# Altium project Main.PrjPCB (part 1 of 2)
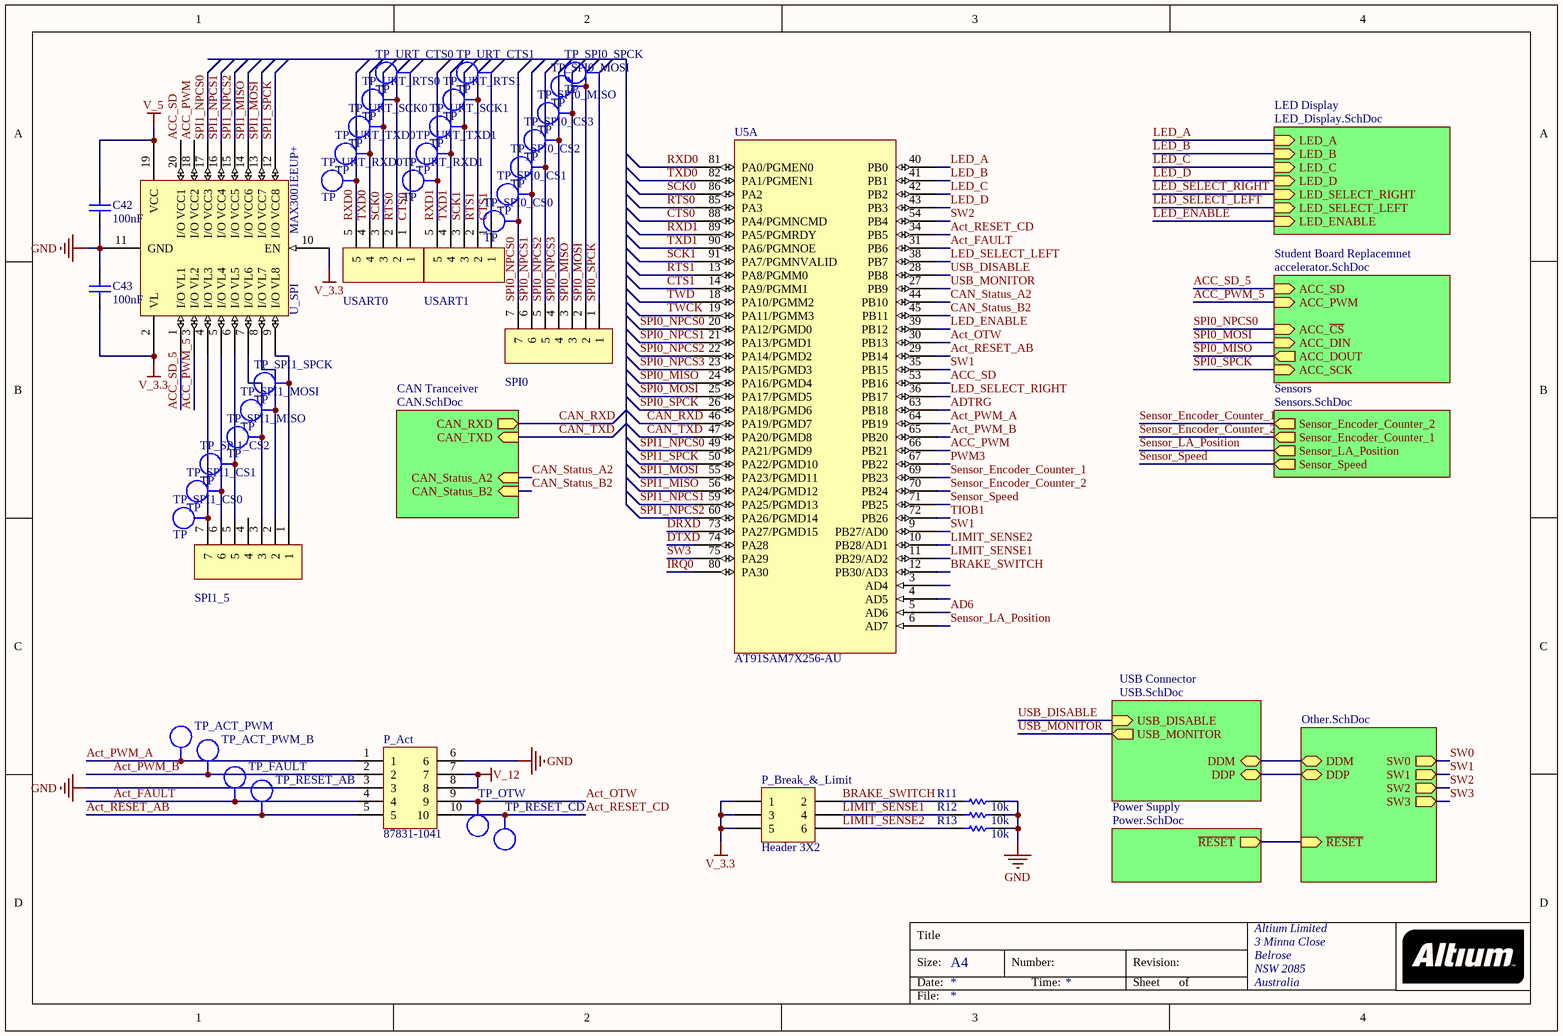
[diagram p0: Main.SchDoc]
8 sheets, 235 parts. Net scope: hierarchical (ports join the sheet entries above them; power ports are global).
Board file: Main.PcbDoc
Sheets:
  Main.SchDoc
     = Other.SchDoc
    CAN Tranceiver = CAN.SchDoc
    USB Connector = USB.SchDoc
    Power Supply = Power.SchDoc
    Sensors = Sensors.SchDoc
    Student Board Replacemnet = accelerator.SchDoc
    LED Display = LED_Display.SchDoc

## Sheet Main.SchDoc
size A4; Organization: Altium Limited; Address1: 3 Minna Close; Address2: Belrose; Address3: NSW 2085; Address4: Australia

### Parts
C42  100nF  [0603]
C43  100nF  [0603]
P_Act  87831-1041  [87831-1041]
P_Break_&_Limit  Header 3X2  [HDR2X3]
R11  10k  [0603]
R12  10k  [0603]
R13  10k  [0603]
SPI0  53261-0771  [53261-0771]  (value not drawn)
SPI1_5  53261-0771  [53261-0771]  (value not drawn)
TP_ACT_PWM  TP  [TEST_POINT_4X2MM]  (value not drawn)  (no BOM)
TP_ACT_PWM_B  TP  [TEST_POINT_4X2MM]  (value not drawn)  (no BOM)
TP_FAULT  TP  [TEST_POINT_4X2MM]  (value not drawn)  (no BOM)
TP_OTW  TP  [TEST_POINT_4X2MM]  (value not drawn)  (no BOM)
TP_RESET_AB  TP  [TEST_POINT_4X2MM]  (value not drawn)  (no BOM)
TP_RESET_CD  TP  [TEST_POINT_4X2MM]  (value not drawn)  (no BOM)
TP_SPI0_CS0  TP  [TEST_POINT_4X2MM]  (no BOM)
TP_SPI0_CS1  TP  [TEST_POINT_4X2MM]  (no BOM)
TP_SPI0_CS2  TP  [TEST_POINT_4X2MM]  (no BOM)
TP_SPI0_CS3  TP  [TEST_POINT_4X2MM]  (no BOM)
TP_SPI0_MISO  TP  [TEST_POINT_4X2MM]  (no BOM)
TP_SPI0_MOSI  TP  [TEST_POINT_4X2MM]  (no BOM)
TP_SPI0_SPCK  TP  [TEST_POINT_4X2MM]  (no BOM)
TP_SPI1_CS0  TP  [TEST_POINT_4X2MM]  (no BOM)
TP_SPI1_CS1  TP  [TEST_POINT_4X2MM]  (no BOM)
TP_SPI1_CS2  TP  [TEST_POINT_4X2MM]  (no BOM)
TP_SPI1_MISO  TP  [TEST_POINT_4X2MM]  (no BOM)
TP_SPI1_MOSI  TP  [TEST_POINT_4X2MM]  (no BOM)
TP_SPI1_SPCK  TP  [TEST_POINT_4X2MM]  (no BOM)
TP_URT_CTS0  TP  [TEST_POINT_4X2MM]  (no BOM)
TP_URT_CTS1  TP  [TEST_POINT_4X2MM]  (no BOM)
TP_URT_RTS0  TP  [TEST_POINT_4X2MM]  (no BOM)
TP_URT_RTS1  TP  [TEST_POINT_4X2MM]  (no BOM)
TP_URT_RXD0  TP  [TEST_POINT_4X2MM]  (no BOM)
TP_URT_RXD1  TP  [TEST_POINT_4X2MM]  (no BOM)
TP_URT_SCK0  TP  [TEST_POINT_4X2MM]  (no BOM)
TP_URT_SCK1  TP  [TEST_POINT_4X2MM]  (no BOM)
TP_URT_TXD0  TP  [TEST_POINT_4X2MM]  (no BOM)
TP_URT_TXD1  TP  [TEST_POINT_4X2MM]  (no BOM)
U5  AT91SAM7X256-AU  [LQFP100_N]  (part A of 4)
U_SPI  MAX3001EEUP+  [TSOP65P640X110-20N]
USART0  53261-0571  [53261-0571]  (value not drawn)
USART1  53261-0571  [53261-0571]  (value not drawn)

### Sub-sheets
CAN Tranceiver = CAN.SchDoc: CAN_TXD (in), CAN_RXD (out), CAN_Status_A2 (in), CAN_Status_B2 (in)
LED Display = LED_Display.SchDoc: LED_ENABLE (in), LED_A (in), LED_B (in), LED_C (in), LED_D (in), LED_SELECT_LEFT (in), LED_SELECT_RIGHT (in)
Power Supply = Power.SchDoc: ~{RESET} (out)
Sensors = Sensors.SchDoc: Sensor_Speed (out), Sensor_LA_Position (out), Sensor_Encoder_Counter_2 (out), Sensor_Encoder_Counter_1 (out)
Student Board Replacemnet = accelerator.SchDoc: ACC_PWM (in), ACC_SD (in), ACC_~{CS} (in), ACC_DIN (in), ACC_DOUT (out), ACC_SCK (in)
USB Connector = USB.SchDoc: USB_DISABLE (in), USB_MONITOR (out), DDM (bidir), DDP (bidir)
? = Other.SchDoc: DDM (bidir), DDP (bidir), ~{RESET} (in), SW2 (out), SW3 (out), SW0 (out), SW1 (out)

### Nets
GND: C42.1 C43.2 P_Act.3 P_Act.6 R11.2 R12.2 R13.2 U_SPI.11(GND)
V_3.3: C43.1 P_Break_&_Limit.1 P_Break_&_Limit.3 P_Break_&_Limit.5 U_SPI.2(VL) U_SPI.10(EN)
V_5: C42.2 U_SPI.19(VCC)
V_12: P_Act.7 P_Act.8
ACC_PWM: U5.66(PB21) U_SPI.18(I/O_VCC2)
ACC_PWM_5: U_SPI.3(I/O_VL2) ; sheet Student Board Replacemnet/ACC_PWM
ACC_SD: U5.53(PB16) U_SPI.20(I/O_VCC1)
ACC_SD_5: U_SPI.1(I/O_VL1) ; sheet Student Board Replacemnet/ACC_SD
Act_FAULT: P_Act.4 TP_FAULT.1 U5.31(PB6)
Act_OTW: P_Act.9 TP_OTW.1 U5.30(PB13)
Act_PWM_A: P_Act.1 TP_ACT_PWM.1 U5.64(PB19)
Act_PWM_B: P_Act.2 TP_ACT_PWM_B.1 U5.65(PB20)
Act_RESET_AB: P_Act.5 TP_RESET_AB.1 U5.29(PB14)
Act_RESET_CD: P_Act.10 TP_RESET_CD.1 U5.34(PB5)
AD6: U5.5(AD6)
ADTRG: U5.63(PB18)
BRAKE_SWITCH: P_Break_&_Limit.2 R11.1 U5.12(PB30/AD3)
CAN_RXD: U5.46(PA19/PGMD7) ; sheet CAN Tranceiver/CAN_RXD
CAN_Status_A2: U5.44(PB10) ; sheet CAN Tranceiver/CAN_Status_A2
CAN_Status_B2: U5.45(PB11) ; sheet CAN Tranceiver/CAN_Status_B2
CAN_TXD: U5.47(PA20/PGMD8) ; sheet CAN Tranceiver/CAN_TXD
CTS0: TP_URT_CTS0.1 U5.88(PA4/PGMNCMD) USART0.1
CTS1: TP_URT_CTS1.1 U5.14(PA9/PGMM1) USART1.1
DRXD: U5.73(PA27/PGMD15)
DTXD: U5.74(PA28)
IRQ0: U5.80(PA30)
LED_A: U5.40(PB0) ; sheet LED Display/LED_A
LED_B: U5.41(PB1) ; sheet LED Display/LED_B
LED_C: U5.42(PB2) ; sheet LED Display/LED_C
LED_D: U5.43(PB3) ; sheet LED Display/LED_D
LED_ENABLE: U5.39(PB12) ; sheet LED Display/LED_ENABLE
LED_SELECT_LEFT: U5.38(PB7) ; sheet LED Display/LED_SELECT_LEFT
LED_SELECT_RIGHT: U5.36(PB17) ; sheet LED Display/LED_SELECT_RIGHT
LIMIT_SENSE1: P_Break_&_Limit.4 R12.1 U5.11(PB29/AD2)
LIMIT_SENSE2: P_Break_&_Limit.6 R13.1 U5.10(PB28/AD1)
PWM3: U5.67(PB22)
RST: sheet /~{RESET}, sheet Power Supply/~{RESET}
RTS0: TP_URT_RTS0.1 U5.85(PA3) USART0.2
RTS1: TP_URT_RTS1.1 U5.13(PA8/PGMM0) USART1.2
RXD0: TP_URT_RXD0.1 U5.81(PA0/PGMEN0) USART0.5
RXD1: TP_URT_RXD1.1 U5.89(PA5/PGMRDY) USART1.5
SCK0: TP_URT_SCK0.1 U5.86(PA2) USART0.3
SCK1: TP_URT_SCK1.1 U5.91(PA7/PGMNVALID) USART1.3
Sensor_Encoder_Counter_1: U5.69(PB23) ; sheet Sensors/Sensor_Encoder_Counter_2
Sensor_Encoder_Counter_2: U5.70(PB24) ; sheet Sensors/Sensor_Encoder_Counter_1
Sensor_LA_Position: U5.6(AD7) ; sheet Sensors/Sensor_LA_Position
Sensor_Speed: U5.71(PB25) ; sheet Sensors/Sensor_Speed
SPI0_MISO: SPI0.3 TP_SPI0_MISO.1 U5.24(PA16/PGMD4) ; sheet Student Board Replacemnet/ACC_DOUT
SPI0_MOSI: SPI0.2 TP_SPI0_MOSI.1 U5.25(PA17/PGMD5) ; sheet Student Board Replacemnet/ACC_DIN
SPI0_NPCS0: SPI0.7 TP_SPI0_CS0.1 U5.20(PA12/PGMD0) ; sheet Student Board Replacemnet/ACC_~{CS}
SPI0_NPCS1: SPI0.6 TP_SPI0_CS1.1 U5.21(PA13/PGMD1)
SPI0_NPCS2: SPI0.5 TP_SPI0_CS2.1 U5.22(PA14/PGMD2)
SPI0_NPCS3: SPI0.4 TP_SPI0_CS3.1 U5.23(PA15/PGMD3)
SPI0_SPCK: SPI0.1 TP_SPI0_SPCK.1 U5.26(PA18/PGMD6) ; sheet Student Board Replacemnet/ACC_SCK
SPI1_MISO: U5.56(PA24/PGMD12) U_SPI.14(I/O_VCC6)
SPI1_MOSI: U5.55(PA23/PGMD11) U_SPI.13(I/O_VCC7)
SPI1_NPCS0: U5.49(PA21/PGMD9) U_SPI.17(I/O_VCC3)
SPI1_NPCS1: U5.59(PA25/PGMD13) U_SPI.16(I/O_VCC4)
SPI1_NPCS2: U5.60(PA26/PGMD14) U_SPI.15(I/O_VCC5)
SPI1_SPCK: U5.50(PA22/PGMD10) U_SPI.12(I/O_VCC8)
SW1: U5.9(PB27/AD0) U5.35(PB15) ; sheet /SW1
SW2: U5.54(PB4) ; sheet /SW2
SW3: U5.75(PA29) ; sheet /SW3
TIOB1: U5.72(PB26)
TWCK: U5.19(PA11/PGMM3)
TWD: U5.18(PA10/PGMM2)
TXD0: TP_URT_TXD0.1 U5.82(PA1/PGMEN1) USART0.4
TXD1: TP_URT_TXD1.1 U5.90(PA6/PGMNOE) USART1.4
USB_DISABLE: U5.28(PB8) ; sheet USB Connector/USB_DISABLE
USB_MONITOR: U5.27(PB9) ; sheet USB Connector/USB_MONITOR
NetR71_1: sheet /DDM, sheet USB Connector/DDM
NetR72_1: sheet /DDP, sheet USB Connector/DDP
NetSPI1_5_1: SPI1_5.1 TP_SPI1_SPCK.1 U_SPI.9(I/O_VL8)
NetSPI1_5_2: SPI1_5.2 TP_SPI1_MOSI.1 U_SPI.8(I/O_VL7)
NetSPI1_5_3: SPI1_5.3 TP_SPI1_MISO.1 U_SPI.7(I/O_VL6)
NetSPI1_5_5: SPI1_5.5 TP_SPI1_CS2.1 U_SPI.6(I/O_VL5)
NetSPI1_5_6: SPI1_5.6 TP_SPI1_CS1.1 U_SPI.5(I/O_VL4)
NetSPI1_5_7: SPI1_5.7 TP_SPI1_CS0.1 U_SPI.4(I/O_VL3)

Not connected (* = marked no-connect by the designer): SPI1_5 4; U5 3(AD4) 4(AD5)

### Notes on the sheet
- Title
- Size:
- Date:
- A4
- Number:
- Time:
- Revision:
- Sheet
- of
- File:

### Library data of the parts
C42 C43 = CP_100nF 0603: CAP CER .10UF 50V X5R 0603; Manufacturer: Taiyo Yuden; Manufacturer PN: UMK107B7104KA-T; LatestRevisionDate: 29 May 08; Supplier 1: Digi-Key; Supplier Part Number 1: 478-6206-1-ND; Value: 100nF; Part Number: CP_100nF 0603; Component Kind: Standard; Component Type: Standard; Designator: CP_100nF 0603; Pin Count: 2; Signal Integrity: Cap; Simulation: CAP
P_Act = 87831-1041: HEADER MALE 10POS VERT W/LOCK; Manufacturer: Molex; Manufacturer PN: 87831-1041; Supplier 1: Digi-Key; Supplier Part Number 1: WM3591-ND
P_Break_&_Limit = Header 3X2: Header, 3-Pin, Dual row; LatestRevisionDate: 17-Jul-2002; LatestRevisionNote: Re-released for DXP Platform.; Publisher: Altium Limited
R11-R13 = RS_10k 0603: RES 10.0K OHM 1/10W 1% 0603 SMD; Manufacturer: Yageo; Manufacturer PN: RC0603FR-0710KL; LatestRevisionDate: 29 May 08; Supplier 1: Digi-Key; Supplier Part Number 1: 311-10.0KHRTR-ND; Value: 10k; Part Number: RS_10k 0603; Component Kind: Standard; Component Type: Standard; Designator: RS_10k 0603; Pin Count: 2; Signal Integrity: Res; Simulation: RESISTOR
SPI0 SPI1_5 = 53261-0771: 7-pin PicoBlade Right-angle Header; Manufacturer: Molex; Manufacturer Part Number: 53261-0771
  SPI0: Supplier: Digikey; Supplier Part Number: WM7625CT-ND
  SPI1_5: Supplier 1: Digikey; Supplier Part Number 1: WM7625CT-ND
TP_ACT_PWM TP_ACT_PWM_B TP_FAULT TP_OTW TP_RESET_AB TP_RESET_CD TP_SPI0_CS0-TP_SPI0_CS3 TP_SPI0_MISO TP_SPI0_MOSI TP_SPI0_SPCK TP_SPI1_CS0-TP_SPI1_CS2 TP_SPI1_MISO TP_SPI1_MOSI TP_SPI1_SPCK TP_URT_CTS0 TP_URT_CTS1 TP_URT_RTS0 TP_URT_RTS1 TP_URT_RXD0 TP_URT_RXD1 TP_URT_SCK0 TP_URT_SCK1 TP_URT_TXD0 TP_URT_TXD1 = TP_TESTPOINT: Test-Point; LatestRevisionDate: 29 May 08; Manufacturer PN: *; Manufacturer: *; Supplier 1: Digi-Key; Supplier Part Number 1: 5016KTR-ND; Value: TP; Part Number: TP_TESTPOINT; Component Type: Standard (No BOM); Designator: TP_TESTPOINT; Pin Count: 1
U5 = AT91SAM7X256-AU: ARM7TDMI 32-Bit RISC CPU 256KB Flash and 64KB SRAM; Manafacture Part Number: AT91SAM7XC256B-AU; Manafacture: Atmel; Published: 16-Oct-2006; DatasheetVersion: 17-Oct-2005; PackageVersion: Apr-2006; PackageReference: LQFP100; Publisher: Altium Limited; PackageDescription: 100-Pin Thin Quad Flat Pack 0.5 mm Pitch; Code_JEDEC: MS-026-BED; ComponentLink1Description: Manufacturer Link; ComponentLink1URL: http://www.atmel.com; ComponentLink2Description: Datasheet; ComponentLink2URL: http://www.atmel.com/dyn/resources/prod_documents/6120s.pdf; Supplier 1: Digi-Key; Supplier Part Number 1: AT91SAM7XC256B-AU-ND
U_SPI = MAX3001EEUP+: Manufacture: MAXIM INTEGRATED PRODUCTS; Supplier Part Number 1: 1379763; Supplier 1: Element 14; Manufacture PN: MAX3001EEUP+
USART0 USART1 = 53261-0571: 5-pin PicoBlade Right-angle Header; Manufacturer: Molex; Manufacturer Part Number: 53261-0571
  USART0: Supplier: Digikey; Supplier Part Number: WM7623CT-ND
  USART1: Supplier 1: Digikey; Supplier Part Number 1: WM7623CT-ND

## Sheet Other.SchDoc
size A4; Organization: Altium Limited; Address1: 3 Minna Close; Address2: Belrose; Address3: NSW 2085; Address4: Australia
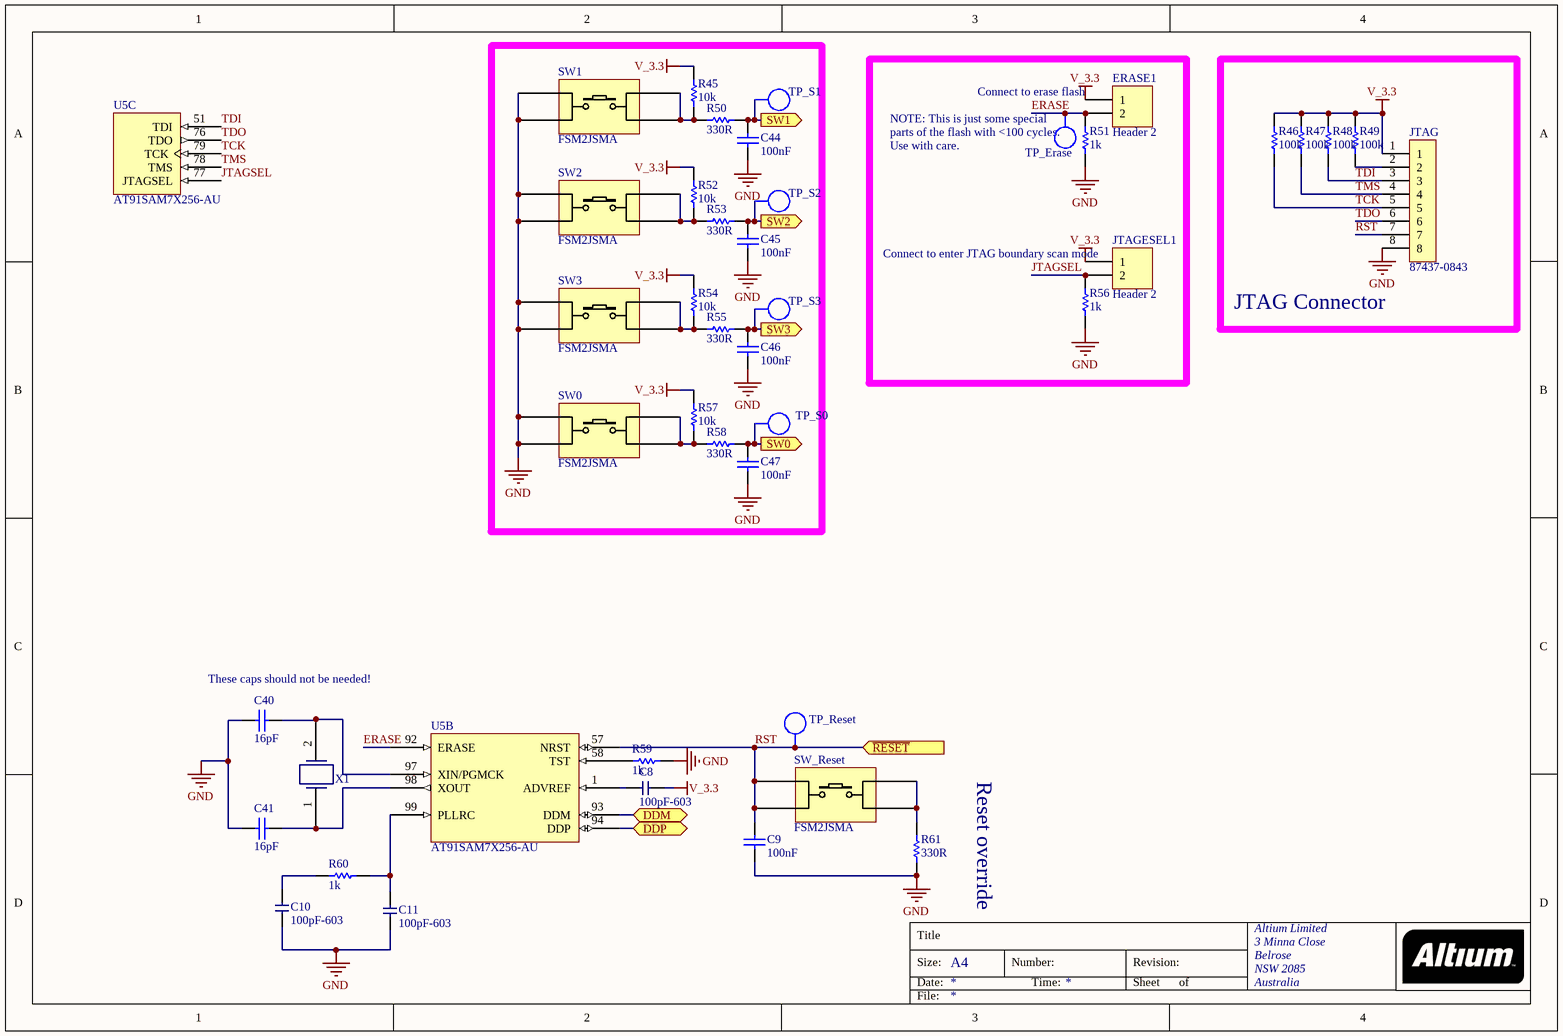
[diagram p1: Other.SchDoc]

### Parts
C8  100pF-603  [0603 Resistor]
C9  100nF  [0603]
C10  100pF-603  [0603 Resistor]
C11  100pF-603  [0603 Resistor]
C40  16pF  [0603]
C41  16pF  [0603]
C44  100nF  [0603]
C45  100nF  [0603]
C46  100nF  [0603]
C47  100nF  [0603]
ERASE1  Header 2  [HDR1X2]
JTAG  87437-0843  [87437-0843]
JTAGESEL1  Header 2  [HDR1X2]
R45  10k  [0603]
R46  100k  [0603]
R47  100k  [0603]
R48  100k  [0603]
R49  100k  [0603]
R50  330R  [0603]
R51  1k  [0603]
R52  10k  [0603]
R53  330R  [0603]
R54  10k  [0603]
R55  330R  [0603]
R56  1k  [0603]
R57  10k  [0603]
R58  330R  [0603]
R59  1k  [0603]
R60  1k  [0603]
R61  330R  [0603]
SW0  FSM2JSMA  [FSM2JSMA]
SW1  FSM2JSMA  [FSM2JSMA]
SW2  FSM2JSMA  [FSM2JSMA]
SW3  FSM2JSMA  [FSM2JSMA]
SW_Reset  FSM2JSMA  [FSM2JSMA]
TP_Erase  TP  [TEST_POINT_4X2MM]  (value not drawn)  (no BOM)
TP_Reset  TP  [TEST_POINT_4X2MM]  (value not drawn)  (no BOM)
TP_S0  TP  [TEST_POINT_4X2MM]  (value not drawn)  (no BOM)
TP_S1  TP  [TEST_POINT_4X2MM]  (value not drawn)  (no BOM)
TP_S2  TP  [TEST_POINT_4X2MM]  (value not drawn)  (no BOM)
TP_S3  TP  [TEST_POINT_4X2MM]  (value not drawn)  (no BOM)
U5  AT91SAM7X256-AU  [LQFP100_N]  (parts B,C of 4)
X1  ECS-184-20-5PXDU-TR  [HC49/US]  (value not drawn)

### Blocks framed on the sheet
JTAG Connector: JTAG R46-R49

### Ports
DDM (bidir), DDP (bidir), SW0 (out), SW1 (out), SW2 (out), SW3 (out), ~{RESET} (in)

### Nets
GND: C9.2 C10.1 C11.1 C40.1 C41.2 C44.1 C45.1 C46.1 C47.1 JTAG.8 R51.1 R56.1 R59.1 R61.1 SW0.1 SW0.2 SW1.1 SW1.2 SW2.1 SW2.2 SW3.1 SW3.2
V_3.3: C8.2 ERASE1.1 JTAG.1 JTAGESEL1.1 R45.2 R46.1 R47.1 R48.1 R49.1 R52.2 R54.2 R57.2
ERASE: ERASE1.2 R51.2 TP_Erase.1 U5.92(ERASE)
JTAGSEL: JTAGESEL1.2 R56.2 U5.77(JTAGSEL)
RST: C9.1 JTAG.7 SW_Reset.1 SW_Reset.2 TP_Reset.1 U5.57(NRST) ; port ~{RESET}
SW0: C47.2 R58.2 TP_S0.1 ; port SW0
SW1: C44.2 R50.2 TP_S1.1 ; port SW1
SW2: C45.2 R53.2 TP_S2.1 ; port SW2
SW3: C46.2 R55.2 TP_S3.1 ; port SW3
TCK: JTAG.5 R46.2 U5.79(TCK)
TDI: JTAG.3 R48.2 U5.51(TDI)
TDO: JTAG.6 U5.76(TDO)
TMS: JTAG.4 R47.2 U5.78(TMS)
NetC8_1: C8.1 U5.1(ADVREF)
NetC10_2: C10.2 R60.1
NetC11_2: C11.2 R60.2 U5.99(PLLRC)
NetC40_2: C40.2 U5.97(XIN/PGMCK) X1.2
NetC41_1: C41.1 U5.98(XOUT) X1.1
NetJTAG_2: JTAG.2 R49.2
NetR45_1: R45.1 R50.1 SW1.3 SW1.4
NetR52_1: R52.1 R53.1 SW2.3 SW2.4
NetR54_1: R54.1 R55.1 SW3.3 SW3.4
NetR57_1: R57.1 R58.1 SW0.3 SW0.4
NetR59_2: R59.2 U5.58(TST)
NetR61_2: R61.2 SW_Reset.3 SW_Reset.4
NetR71_1: U5.93(DDM) ; port DDM
NetR72_1: U5.94(DDP) ; port DDP

### Notes on the sheet
- (near ERASE1) Connect to erase flash
- (near TP_Erase) NOTE: This is just some special
- parts of the flash with <100 cycles.
- Use with care.
- (near JTAGESEL1) Connect to enter JTAG boundary scan mode
- (near C40) These caps should not be needed!
- Reset override
- Title
- Size:
- Date:
- A4
- Number:
- Time:
- Revision:
- Sheet
- of
- File:

### Library data of the parts
C8 C10 C11 = 100pF-603: Manufacturer Part Number: 06035A101JAT2A; Manufacturer: AVX Corporation; Supplier 1: Digi-Key; Supplier Part Number 1: 478-1175-1-ND
C9 C44-C47 = CP_100nF 0603: as C42 on sheet Main; Value: 100nF; Part Number: CP_100nF 0603; Component Kind: Standard; Component Type: Standard; Designator: CP_100nF 0603; Pin Count: 2; LatestRevisionDate: 29 May 08; Supplier 1: Digi-Key; Supplier Part Number 1: 478-6206-1-ND; Signal Integrity: Cap; Simulation: CAP
C40 C41 = CP_16pF_100V_0603: CAP CER 16PF 100V 5% C0G 0603; Manufacturer: Murata; Manufacturer PN: GRM1885C2A160JA01D; Supplier 1: Digi-Key; Supplier Part Number 1: 490-1332-1-ND; Value: 16pF; Part Number: CP_16pF_100V_0603; Component Kind: Standard; Component Type: Standard; Designator: CP_16pF_100V_0603; Pin Count: 2; Signal Integrity: Cap; Simulation: CAP
ERASE1 JTAGESEL1 = Header 2: Header, 2-Pin; LatestRevisionDate: 17-Jul-2002; LatestRevisionNote: Re-released for DXP Platform.; Publisher: Altium Limited
JTAG = 87437-0843: Manufacturer: Molex; Manufacturer Part Number: 87437-0843; Supplier 1: Digikey; Supplier Part Number 1: WM7667CT-ND
R45 R52 R54 R57 = RS_10k 0603: as R11 on sheet Main; LatestRevisionDate: 29 May 08; Supplier 1: Digi-Key; Supplier Part Number 1: 311-10.0KHRTR-ND; Value: 10k; Part Number: RS_10k 0603; Component Kind: Standard; Component Type: Standard; Designator: RS_10k 0603; Pin Count: 2; Signal Integrity: Res; Simulation: RESISTOR
R46-R49 = RS_100k 0603: RES 100K OHM 1/10W 1% 0603 SMD; Manufacturer: Yageo; Manufacturer PN: RC0603FR-07100KL; Value: 100k; Part Number: RS_100k 0603; Component Kind: Standard; Component Type: Standard; Designator: RS_100k 0603; Pin Count: 2; LatestRevisionDate: 1 Jun 08; Supplier 1: Digi-Key; Supplier Part Number 1: 311-100KHRTR-ND; Signal Integrity: Res; Simulation: RESISTOR
R50 R53 R55 R58 R61 = RS_330R 0603: RES 330 OHM 1/10W 1% 0603 SMD; Manufacturer: Yageo; Manufacturer PN: RC0603FR-07330RL; LatestRevisionDate: 25 June 2009; Supplier 1: Digi-Key; Supplier Part Number 1: 311-330HRTR-ND; Value: 330R; Part Number: RS_330R 0603; Component Kind: Standard; Component Type: Standard; Designator: RS_330R 0603; Pin Count: 2; Signal Integrity: Res; Simulation: RESISTOR
R51 R56 R59 R60 = RS_1k 0603: RES 1.00K OHM 1/10W 1% 0603 SMD; Manufacturer: ROHM; Manufacturer PN: MCR03EZPFX1001; Value: 1k; Part Number: RS_1k 0603; Component Kind: Standard; Component Type: Standard; Designator: RS_1k 0603; Pin Count: 2; LatestRevisionDate: 17-Jul-2002; Supplier 1: Digi-Key; Supplier Part Number 1: RHM1.00KHTR-ND; Signal Integrity: Res; Simulation: RESISTOR
SW0-SW3 SW_Reset = SW_FSM2JSMA: DPST SMD Switch; Manufacturer: Tyco Electronics; Supplier 1: Element 14; Supplier Part Number 1: 3801287; price: 0.516; Supplier 2: Digi-Key; Supplier Part Number 2: 450-1130-ND; value: FSM2JSMA; Part Number: SW_FSM2JSMA; Component Kind: Standard; Component Type: Standard; Designator: SW_FSM2JSMA; Pin Count: 4
TP_Erase TP_Reset TP_S0-TP_S3 = TP_TESTPOINT: Test-Point; LatestRevisionDate: 29 May 08; Manufacturer PN: *; Manufacturer: *; Supplier 1: Digi-Key; Supplier Part Number 1: 5016KTR-ND; Value: TP; Part Number: TP_TESTPOINT; Component Type: Standard (No BOM); Designator: TP_TESTPOINT; Pin Count: 1
U5 = AT91SAM7X256-AU: Smart ARM Microcontroller, ARM7TDMI 32-Bit RISC CPU, 256KB Flash and 64KB SRAM, 100-Pin LQFP, Industrial, Pb-Free; Published: 16-Oct-2006; DatasheetVersion: 17-Oct-2005; PackageVersion: Apr-2006; PackageReference: LQFP100; Publisher: Altium Limited; PackageDescription: 100-Pin Thin Quad Flat Pack 0.5 mm Pitch; Code_JEDEC: MS-026-BED; ComponentLink1Description: Manufacturer Link; ComponentLink1URL: http://www.atmel.com; ComponentLink2Description: Datasheet; ComponentLink2URL: http://www.atmel.com/dyn/resources/prod_documents/6120s.pdf
X1 = ECS-184-20-5PXDU-TR: Manufacturer: ECS Inc; Supplier 1: Digikey; Manufacturer Part Number: ECS-184-20-5PXDU-TR; Supplier Part Number 1: XC1536CT-ND

## Sheet CAN.SchDoc: CAN Bus
size A4; Organization: ENEL429 Group N; Address1: ECE Department; Address2: University of Canterbury; Address3: Christchurch 8041; Address4: New Zealand; Revision: 1
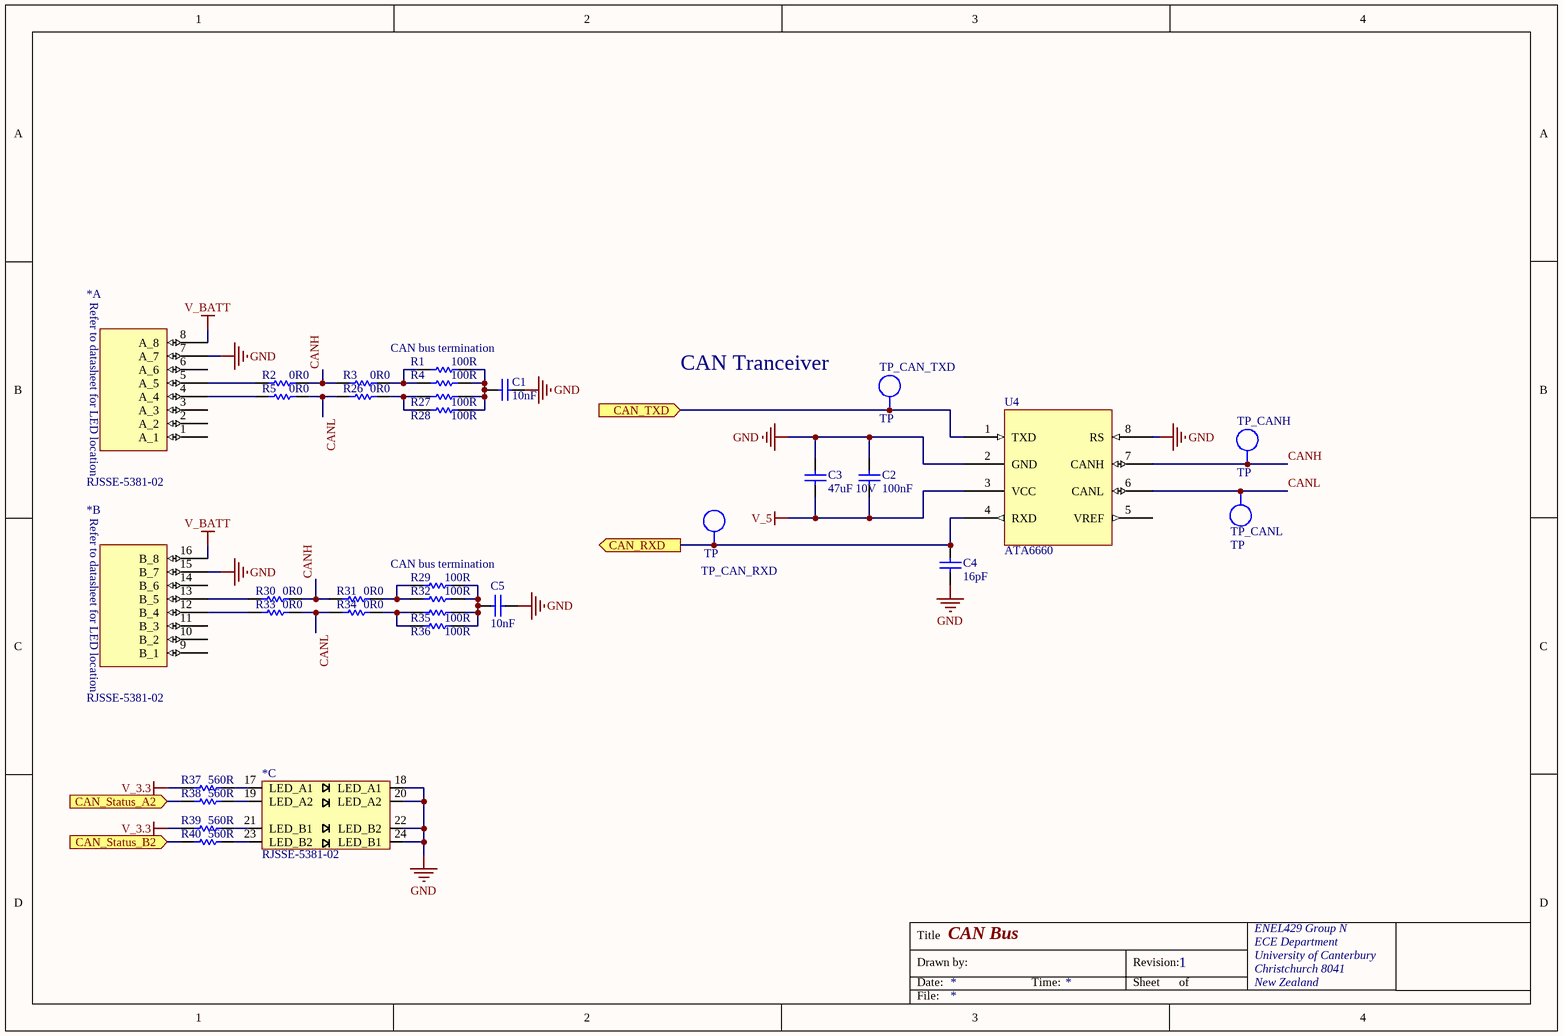
[diagram p2: CAN.SchDoc]

### Parts
(Parts that share a designator on the sheet are numbered #1, #2 ... from top to bottom, then left to right.)
*#1  RJSSE-5381-02  [RJSSE-5381-02]  (part A of 3)
*#2  RJSSE-5381-02  [RJSSE-5381-02]  (part B of 3)
*#3  RJSSE-5381-02  [RJSSE-5381-02]  (part C of 3)
C1  10nF  [0603]
C2  100nF  [0603]
C3  47uF 10V  [1210]
C4  16pF  [0603]
C5  10nF  [0603]
R1  100R  [0603]
R2  0R0  [0603]  (no BOM)
R3  0R0  [0603]  (no BOM)
R4  100R  [0603]
R5  0R0  [0603]  (no BOM)
R26  0R0  [0603]  (no BOM)
R27  100R  [0603]
R28  100R  [0603]
R29  100R  [0603]
R30  0R0  [0603]  (no BOM)
R31  0R0  [0603]  (no BOM)
R32  100R  [0603]
R33  0R0  [0603]  (no BOM)
R34  0R0  [0603]  (no BOM)
R35  100R  [0603]
R36  100R  [0603]
R37  560R  [0603]
R38  560R  [0603]
R39  560R  [0603]
R40  560R  [0603]
TP_CAN_RXD  TP  [TEST_POINT_4X2MM]  (no BOM)
TP_CAN_TXD  TP  [TEST_POINT_4X2MM]  (no BOM)
TP_CANH  TP  [TEST_POINT_4X2MM]  (no BOM)
TP_CANL  TP  [TEST_POINT_4X2MM]  (no BOM)
U4  ATA6660  [SOIC127P600X150-8N]

### Ports
CAN_RXD (out), CAN_Status_A2 (in), CAN_Status_B2 (in), CAN_TXD (in)

### Nets
GND: *#1.7(A_7) *#2.15(B_7) *#3.18(LED_A1) *#3.20(LED_A2) *#3.22(LED_B2) *#3.24(LED_B1) C1.1 C2.2 C3.2 C4.1 C5.1 U4.2(GND) U4.8(RS)
V_3.3: R37.1 R39.1
V_5: C2.1 C3.1 U4.3(VCC)
V_BATT: *#1.8(A_8) *#2.16(B_8)
CAN_RXD: C4.2 TP_CAN_RXD.1 U4.4(RXD) ; port CAN_RXD
CAN_Status_A2: R38.1 ; port CAN_Status_A2
CAN_Status_B2: R40.1 ; port CAN_Status_B2
CAN_TXD: TP_CAN_TXD.1 U4.1(TXD) ; port CAN_TXD
CANH: R2.2 R3.1 R30.2 R31.1 TP_CANH.1 U4.7(CANH)
CANL: R5.2 R26.1 R33.2 R34.1 TP_CANL.1 U4.6(CANL)
Net*#1_4: *#1.4(A_4) R5.1
Net*#1_5: *#1.5(A_5) R2.1
Net*#2_12: *#2.12(B_4) R33.1
Net*#2_13: *#2.13(B_5) R30.1
Net*#3_17: *#3.17(LED_A1) R37.2
Net*#3_19: *#3.19(LED_A2) R38.2
Net*#3_21: *#3.21(LED_B1) R39.2
Net*#3_23: *#3.23(LED_B2) R40.2
NetC1_2: C1.2 R1.2 R4.2 R27.2 R28.2
NetC5_2: C5.2 R29.2 R32.2 R35.2 R36.2
NetR1_1: R1.1 R3.2 R4.1
NetR26_2: R26.2 R27.1 R28.1
NetR29_1: R29.1 R31.2 R32.1
NetR34_2: R34.2 R35.1 R36.1

Not connected (* = marked no-connect by the designer): *#1 1(A_1) 2(A_2) 3(A_3) 6(A_6); *#2 9(B_1) 10(B_2) 11(B_3) 14(B_6); U4 5(VREF)

### Notes on the sheet
- (near R1) CAN bus termination
- CAN Tranceiver
- (near R29) CAN bus termination
- Title
- Drawn by:
- Date:
- Time:
- Revision:
- Sheet
- of
- File:
- (in symbol RJSSE-5381-02, part A) Refer to datasheet for LED location
- (in symbol RJSSE-5381-02, part B) Refer to datasheet for LED location

### Library data of the parts
*#1-*#3 = RJSSE-5381-02: RJ45 SMT Right Angle x2; Manufacturer: Amphenol Commercial Products; Manufacturer Part Number: RJSSE-5381-02; Supplier 1: Digikey; Supplier Part Number 1: RJSSE-5381-02-ND
C1 C5 = CP_10nF 0603: CAP CER 10000PF 100V X7R 0603; Manufacturer: Taiyo Yuden; Manufacturer PN: HMK107B7103KA-T; Value: 10nF; Part Number: CP_10nF 0603; Component Kind: Standard; Component Type: Standard; Designator: CP_10nF 0603; Pin Count: 2; Supplier 1: Digi-Key; Supplier Part Number 1: 587-1446-2-ND; Signal Integrity: Cap; Simulation: CAP
C2 = CP_100nF 0603: as C42 on sheet Main; Value: 100nF; Part Number: CP_100nF 0603; Component Kind: Standard; Component Type: Standard; Designator: CP_100nF 0603; Pin Count: 2; LatestRevisionDate: 29 May 08; Supplier 1: Digi-Key; Supplier Part Number 1: 478-6206-1-ND; Signal Integrity: Cap; Simulation: CAP
C3 = CP_47uF 10V 1210: CAP CER 47uF 10V X5R 1210; Manufacturer: Murata; Manufacturer PN: GRM32ER61A476KE20L; Value: 47uF 10V; Part Number: CP_47uF 10V 1210; Component Kind: Standard; Component Type: Standard; Designator: CP_47uF 10V 1210; Pin Count: 2; LatestRevisionDate: 29 May 08; Supplier 1: Digi-Key; Supplier Part Number 1: 490-3887-1-ND
C4 = CP_16pF_100V_0603: as C40 on sheet Other; Value: 16pF; Part Number: CP_16pF_100V_0603; Component Kind: Standard; Component Type: Standard; Designator: CP_16pF_100V_0603; Pin Count: 2; Supplier 1: Digi-Key; Supplier Part Number 1: 490-1332-1-ND; Signal Integrity: Cap; Simulation: CAP
R1 R4 R27-R29 R32 R35 R36 = RS_100R 0603: RES 100 OHM 1/10W 1% 0603 SMD; Manufacturer: ROHM; Manufacturer PN: MCR03EZPFX1000; LatestRevisionDate: n/a; Supplier 1: Digi-Key; Supplier Part Number 1: RHM100HTR-ND; Value: 100R; Part Number: RS_100R 0603; Component Kind: Standard; Component Type: Standard; Designator: RS_100R 0603; Pin Count: 2; Signal Integrity: Res; Simulation: RESISTOR
R2 R3 R5 R26 R30 R31 R33 R34 = RS_0R0 0603: RES 0.0 OHM 1/10W 5% 0603 SMD; Manufacturer: Rohm; Manufacturer PN: MCR03EZPJ000; LatestRevisionDate: 3 Jun 08; Supplier 1: Digi-Key; Supplier Part Number 1: RHM0.0GTR-ND; Value: 0R0; Part Number: RS_0R0 0603; Component Type: Standard (No BOM); Designator: RS_0R0 0603; Pin Count: 2; Signal Integrity: Res; Simulation: RESISTOR
R37-R40 = RS_560R 0603: RES 560 OHM 1/10W 1% 0603 SMD; Manufacturer: Yageo; Manufacturer PN: RC0603FR-07560RL; Value: 560R; Part Number: RS_560R 0603; Component Kind: Standard; Component Type: Standard; Designator: RS_560R 0603; Pin Count: 2; LatestRevisionDate: 6 May 2011; Supplier 1: Digi-Key; Supplier Part Number 1: 311-560GRTR-ND; Signal Integrity: Res; Simulation: RESISTOR
TP_CAN_RXD TP_CAN_TXD TP_CANH TP_CANL = TP_TESTPOINT: Test-Point; LatestRevisionDate: 29 May 08; Manufacturer PN: *; Manufacturer: *; Supplier 1: Digi-Key; Supplier Part Number 1: 5016KTR-ND; Value: TP; Part Number: TP_TESTPOINT; Component Type: Standard (No BOM); Designator: TP_TESTPOINT; Pin Count: 1
U4 = ATA6660: Manufacturer: Atmel; Manufacturer Part Number: ATA6660-TAPY-19; Supplier 1: Mouser; Supplier Part Number 1: 556-ATA6660TAPY

## Sheet USB.SchDoc
size A4; Organization: ENEL429 Group N; Address1: ECE Department; Address2: University of Canterbury; Address3: Christchurch 8041; Address4: New Zealand; Revision: 1
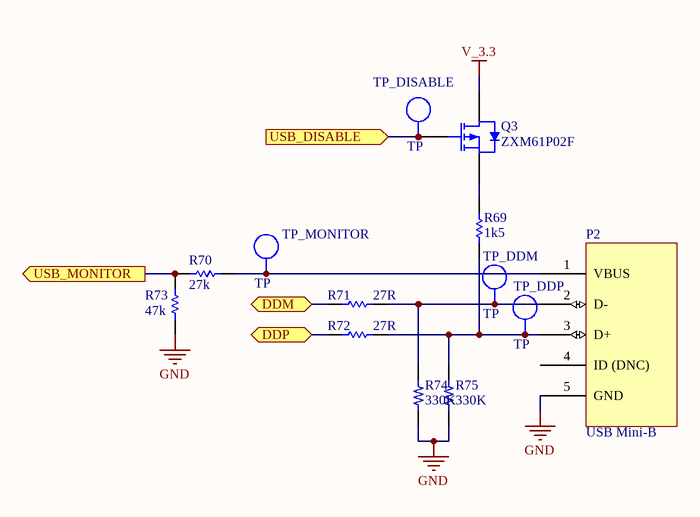
[diagram p3: USB.SchDoc]

### Parts
P2  USB Mini-B  [USB Mini-B]
Q3  ZXM61P02F  [SOT23]
R69  1k5  [0603]
R70  27k  [0603]
R71  27R  [0603]
R72  27R  [0603]
R73  47k  [0603]
R74  330K  [0603 Resistor]
R75  330K  [0603 Resistor]
TP_DDM  TP  [TEST_POINT_4X2MM]  (no BOM)
TP_DDP  TP  [TEST_POINT_4X2MM]  (no BOM)
TP_DISABLE  TP  [TEST_POINT_4X2MM]  (no BOM)
TP_MONITOR  TP  [TEST_POINT_4X2MM]  (no BOM)

### Ports
DDM (bidir), DDP (bidir), USB_DISABLE (in), USB_MONITOR (out)

### Nets
GND: P2.5(GND) R73.1 R74.1 R75.1
V_3.3: Q3.3(D)
USB_DISABLE: Q3.1(G) TP_DISABLE.1 ; port USB_DISABLE
USB_MONITOR: R70.1 R73.2 ; port USB_MONITOR
NetP2_1: P2.1(VBUS) R70.2 TP_MONITOR.1
NetP2_2: P2.2(D-) R71.2 R74.2 TP_DDM.1
NetP2_3: P2.3(D+) R69.1 R72.2 R75.2 TP_DDP.1
NetQ3_2: Q3.2(S) R69.2
NetR71_1: R71.1 ; port DDM
NetR72_1: R72.1 ; port DDP

Not connected (* = marked no-connect by the designer): P2 4(ID_(DNC))

### Notes on the sheet
- Title
- Drawn by:
- Date:
- Time:
- Revision:
- Sheet
- of
- File:

### Library data of the parts
P2 = USB Mini B: Manufacturer: TE Connectivity; Manufacturer Part Number: 1734035-2; Supplier 1: Digikey; Supplier Part Number 1: A31727CT-ND
Q3 = TF_ZXM61P02F: 20V P-channel enhancement mode MOSFET; Manufacturer: Zetex; Supplier 1: Element 14; Supplier Part Number 1: 9525297; price: 1.31; Supplier 2: Digi-Key; Supplier Part Number 2: ZXM61P02FCT-ND; value: ZXM61P02F; Part Number: TF_ZXM61P02F; Component Kind: Standard; Component Type: Standard; Designator: TF_ZXM61P02F; Pin Count: 3; PCB3D: sot23
R69 = RS_1k5 0603: RES 1.5K OHM 1/10W 5% 0603 SMD; Manufacturer: Yageo; Manufacturer PN: RC0603JR-071K5L; Value: 1k5; Part Number: RS_1k5 0603; Component Kind: Standard; Component Type: Standard; Designator: RS_1k5 0603; Pin Count: 2; LatestRevisionDate: 6 May 2011; Supplier 1: Digi-Key; Supplier Part Number 1: 311-1.5KGRTR-ND; Signal Integrity: Res; Simulation: RESISTOR
R70 = RS_27k 0603: RES 27K OHM 1/10W 1% 0603 SMD; Manufacturer: Yageo; Manufacturer PN: RC0603FR-0727KL; LatestRevisionDate: 6 May 2011; Supplier 1: Digi-Key; Supplier Part Number 1: 311-27.0KHRTR-ND; Value: 27k; Part Number: RS_27k 0603; Component Kind: Standard; Component Type: Standard; Designator: RS_27k 0603; Pin Count: 2; Signal Integrity: Res; Simulation: RESISTOR
R71 R72 = RS_27R 0603: RES 27 OHM 1/10W 1% 0603 SMD; Manufacturer: Yageo; Manufacturer PN: RC0603FR-0727KL; Value: 27R; Part Number: RS_27R 0603; Component Kind: Standard; Component Type: Standard; Designator: RS_27R 0603; Pin Count: 2; LatestRevisionDate: 6 May 2011; Supplier 1: Digi-Key; Supplier Part Number 1: 311-27.0HRTR-ND; Signal Integrity: Res; Simulation: RESISTOR
R73 = RS_47k 0603: RES 47.0K OHM 1/10W 1% 0603 SMD; Manufacturer: Yageo; Manufacturer PN: RC0603FR-0747KL; Value: 47k; Part Number: RS_47k 0603; Component Kind: Standard; Component Type: Standard; Designator: RS_47k 0603; Pin Count: 2; LatestRevisionDate: 1 Jun 08; Supplier 1: Digi-Key; Supplier Part Number 1: 311-47.0KHRTR-ND; Signal Integrity: Res; Simulation: RESISTOR
R74 R75 = RS_330K 0603: Manufacturer Part Number: ERJ-3EKF3303V; Manufacturer: Panasonic - ECG; Supplier Part Number 1: P330KHCT-ND; Supplier 1: Digi-Key
TP_DDM TP_DDP TP_DISABLE TP_MONITOR = TP_TESTPOINT: Test-Point; LatestRevisionDate: 29 May 08; Manufacturer PN: *; Manufacturer: *; Supplier 1: Digi-Key; Supplier Part Number 1: 5016KTR-ND; Value: TP; Part Number: TP_TESTPOINT; Component Type: Standard (No BOM); Designator: TP_TESTPOINT; Pin Count: 1

## Sheet Power.SchDoc
size A4; Organization: Altium Limited; Address1: 3 Minna Close; Address2: Belrose; Address3: NSW 2085; Address4: Australia
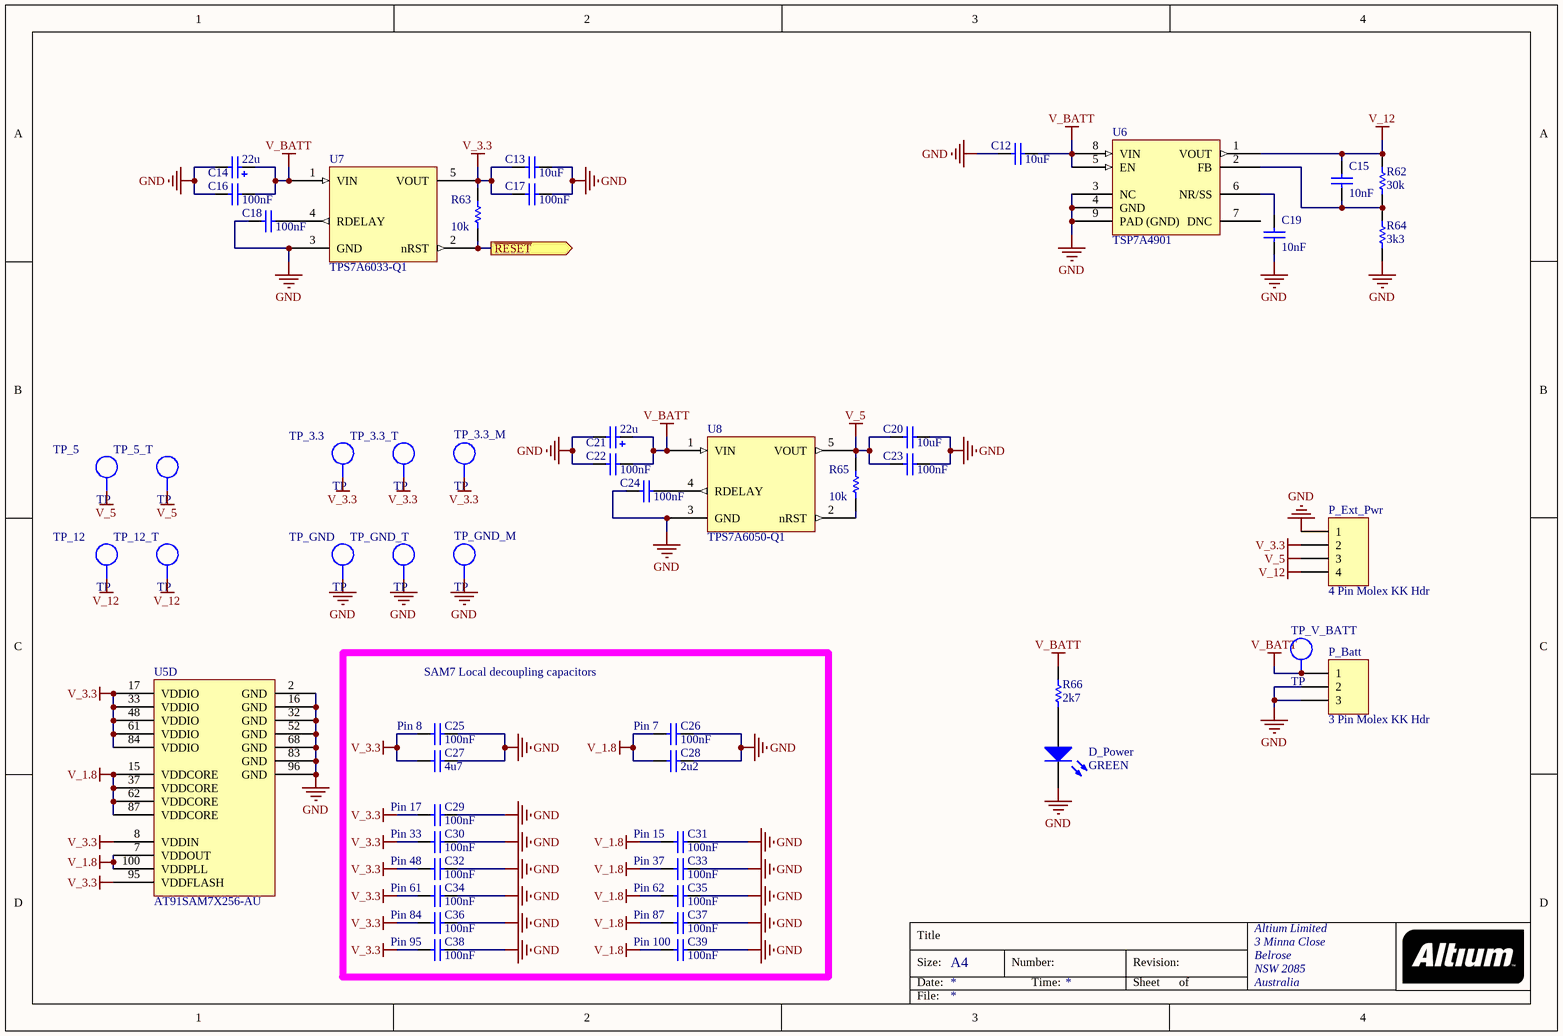
[diagram p4: Power.SchDoc]

### Parts
C12  10uF  [0805]
C13  10uF  [0805]
C14  value 22u  [6032]  (hidden comment: CP_TANT_22uF)
C15  10nF  [0603]
C16  100nF  [0603]
C17  100nF  [0603]
C18  100nF  [0603]
C19  10nF  [0603]
C20  10uF  [0805]
C21  value 22u  [6032]  (hidden comment: CP_TANT_22uF)
C22  100nF  [0603]
C23  100nF  [0603]
C24  100nF  [0603]
C25  100nF  [0603]
C26  100nF  [0603]
C27  4u7  [0603]
C28  2u2  [0603]
C29  100nF  [0603]
C30  100nF  [0603]
C31  100nF  [0603]
C32  100nF  [0603]
C33  100nF  [0603]
C34  100nF  [0603]
C35  100nF  [0603]
C36  100nF  [0603]
C37  100nF  [0603]
C38  100nF  [0603]
C39  100nF  [0603]
D_Power  value GREEN  [DIODE_0805]  (hidden comment: LED Green)
P_Batt  3 Pin Molex KK Hdr  [G_MOLEX_KK_3_HDR]
P_Ext_Pwr  4 Pin Molex KK Hdr  [G_MOLEX_KK_4_HDR]
R62  30k  [0603]
R63  10k  [0603]
R64  3k3  [0603]
R65  10k  [0603]
R66  2k7  [0603]
TP_3.3  TP  [TEST_POINT_4X2MM]  (no BOM)
TP_3.3_M  TP  [TEST_POINT_4X2MM]  (no BOM)
TP_3.3_T  TP  [TEST_POINT_4X2MM]  (no BOM)
TP_5  TP  [TEST_POINT_4X2MM]  (no BOM)
TP_5_T  TP  [TEST_POINT_4X2MM]  (no BOM)
TP_12  TP  [TEST_POINT_4X2MM]  (no BOM)
TP_12_T  TP  [TEST_POINT_4X2MM]  (no BOM)
TP_GND  TP  [TEST_POINT_4X2MM]  (no BOM)
TP_GND_M  TP  [TEST_POINT_4X2MM]  (no BOM)
TP_GND_T  TP  [TEST_POINT_4X2MM]  (no BOM)
TP_V_BATT  TP  [TEST_POINT_4X2MM]  (no BOM)
U5  AT91SAM7X256-AU  [LQFP100_N]  (part D of 4)
U6  TSP7A4901  [TSOP65P490X110_HS-8N]
U7  TPS7A6033-Q1  [TO170P1524X483-6N]
U8  TPS7A6050-Q1  [TO170P1524X483-6N]

### Ports
~{RESET} (out)

### Nets
GND: C12.1 C13.2 C14.2 C16.1 C17.1 C18.1 C19.1 C20.2 C21.2 C22.1 C23.1 C24.1 C25.2 C26.2 C27.2 C28.2 C29.2 C30.2 C31.2 C32.2 C33.2 C34.2 C35.2 C36.2 C37.2 C38.2 C39.2 D_Power.2(K) P_Batt.2 P_Batt.3 P_Ext_Pwr.1 R64.1 TP_GND.1 TP_GND_M.1 TP_GND_T.1 U5.2(GND) U5.16(GND) U5.32(GND) U5.52(GND) U5.68(GND) U5.83(GND) U5.96(GND) U6.3(NC) U6.4(GND) U6.9(PAD_(GND)) U7.3(GND) U8.3(GND)
V_1.8: C26.1 C28.1 C31.1 C33.1 C35.1 C37.1 C39.1 U5.7(VDDOUT) U5.15(VDDCORE) U5.37(VDDCORE) U5.62(VDDCORE) U5.87(VDDCORE) U5.100(VDDPLL)
V_3.3: C13.1 C17.2 C25.1 C27.1 C29.1 C30.1 C32.1 C34.1 C36.1 C38.1 P_Ext_Pwr.2 R63.2 TP_3.3.1 TP_3.3_M.1 TP_3.3_T.1 U5.8(VDDIN) U5.17(VDDIO) U5.33(VDDIO) U5.48(VDDIO) U5.61(VDDIO) U5.84(VDDIO) U5.95(VDDFLASH) U7.5(VOUT)
V_5: C20.1 C23.2 P_Ext_Pwr.3 R65.2 TP_5.1 TP_5_T.1 U8.5(VOUT)
V_12: C15.2 P_Ext_Pwr.4 R62.2 TP_12.1 TP_12_T.1 U6.1(VOUT)
V_BATT: C12.2 C14.1 C16.2 C21.1 C22.2 P_Batt.1 R66.2 TP_V_BATT.1 U6.5(EN) U6.8(VIN) U7.1(VIN) U8.1(VIN)
RST: R63.1 U7.2(nRST) ; port ~{RESET}
NetC15_1: C15.1 R62.1 R64.2 U6.2(FB)
NetC18_2: C18.2 U7.4(RDELAY)
NetC19_2: C19.2 U6.6(NR/SS)
NetC24_2: C24.2 U8.4(RDELAY)
NetD_Power_1: D_Power.1(A) R66.1
NetR65_1: R65.1 U8.2(nRST)

Not connected (* = marked no-connect by the designer): U6 7(DNC)

### Notes on the sheet
- SAM7 Local decoupling capacitors
- (near C25) Pin 8
- (near C26) Pin 7
- (near C29) Pin 17
- (near C30) Pin 33
- (near C31) Pin 15
- (near C32) Pin 48
- (near C34) Pin 61
- (near C36) Pin 84
- (near C33) Pin 37
- (near C35) Pin 62
- (near C37) Pin 87
- (near C38) Pin 95
- (near C39) Pin 100
- Title
- Size:
- Date:
- A4
- Number:
- Time:
- Revision:
- Sheet
- of
- File:

### Library data of the parts
C12 C13 C20 = CP_10uF 0805: CAP 10uF 10% 10V X5R 0805; Manufacturer: Murata; Manufacturer PN: GRM219R61A106KE44D; LatestRevisionDate: 29 May 08; Supplier 1: Digi-Key; Supplier Part Number 1: 490-4735-1-ND; Value: 10uF; Part Number: CP_10uF 0805; Component Kind: Standard; Component Type: Standard; Designator: CP_10uF 0805; Pin Count: 2
C14 C21 = CP_TANT_22uF_35V: CAP TANT 22UF 35V 10% SMD; Manufacturer: Vishay; Manufacturer PN: 293D226X9035D2TE3; Verify: NOT CHECKED; Signal Integrity: Cap Pol; Latest Revision Date: 20 Feb 09; Supplier 1: Digi-Key; Supplier Part Number 1: 718-1071-1-ND; Part Number: CP_TANT_22uF_35V; Component Kind: Standard; Component Type: Standard; Designator: CP_TANT_22uF_35V; Pin Count: 2; Simulation: CAP
C15 C19 = CP_10nF 0603: as C1 on sheet CAN; Supplier 1: Digi-Key; Supplier Part Number 1: 587-1446-2-ND; Value: 10nF; Part Number: CP_10nF 0603; Component Kind: Standard; Component Type: Standard; Designator: CP_10nF 0603; Pin Count: 2; Signal Integrity: Cap; Simulation: CAP
C16-C18 C22-C26 C29-C39 = CP_100nF 0603: as C42 on sheet Main; Value: 100nF; Part Number: CP_100nF 0603; Component Kind: Standard; Component Type: Standard; Designator: CP_100nF 0603; Pin Count: 2; LatestRevisionDate: 29 May 08; Supplier 1: Digi-Key; Supplier Part Number 1: 478-6206-1-ND; Signal Integrity: Cap; Simulation: CAP
C27 = CP_4u7 0603: CAP CER 4.7UF 10V X5R 0603; Manufacturer: Taiyo Yuden LMK107BJ475KA-T; Value: 4u7; Part Number: CP_4u7 0603; Component Kind: Standard; Component Type: Standard; Designator: CP_4u7 0603; Pin Count: 2; LatestRevisionDate: 29 May 08; Supplier 1: Digi-Key; Supplier Part Number 1: 587-1441-1-ND; Simulation: CAP
C28 = CP_2u2F_10V_0603: CAP CER 2.2UF 10V 10% X5R 0603; Manufacturer: Murata Electronics North America; Manufacturer PN: GRM188R61A225KE34D; Verify: not verified; Value: 2u2; Part Number: CP_2u2F_10V_0603; Component Kind: Standard; Component Type: Standard; Designator: CP_2u2F_10V_0603; Pin Count: 2; LatestRevisionDate: 20 Feb 08; Supplier 1: Digi-Key; Supplier Part Number 1: 490-1545-1-ND; Signal Integrity: Cap; Simulation: CAP
D_Power = DL_LED Green 0805: Green LED 0805; Manufacturer: Vishay; Verify: Not checked; Supplier 1: Digi-Key; Supplier Part Number 1: 160-1179-2-ND; Part Number: DL_LED Green 0805; Component Kind: Standard; Component Type: Standard; Designator: DL_LED Green 0805; Footprint: LED_RA_SMD; Pin Count: 2; Simulation: LED0
P_Batt = JP_MOLEX_KK_3POS: CONN HEADER 3POS .100 VERT TIN; Manufacturer: Molex/Waldom; Signal Integrity: Connector; Manufacturer PN: 22-23-2031; Supplier 1: Digi-Key; Supplier Part Number 1: WM4201-ND; Value: 3 Pin Molex KK Hdr; Part Number: JP_MOLEX_KK_3POS; Component Kind: Standard; Component Type: Standard; Designator: JP_MOLEX_KK_3POS; Pin Count: 3
P_Ext_Pwr = JP_MOLEX_KK_4POS: CONN HEADER 4POS .100 VERT TIN; Manufacturer: Molex/Waldom; Signal Integrity: Connector; Manufacturer PN: 22-23-2041; Supplier 1: Digi-Key; Supplier Part Number 1: WM4202-ND; Value: 4 Pin Molex KK Hdr; Part Number: JP_MOLEX_KK_4POS; Component Kind: Standard; Component Type: Standard; Designator: JP_MOLEX_KK_4POS; Pin Count: 4
R62 = RS_30k 0603: RES 30K OHM 1/10W 1% 0603 SMD; Manufacturer: Yageo; Manufacturer PN: RC0603FR-0730KL; LatestRevisionDate: 6 May 2011; Supplier 1: Digi-Key; Supplier Part Number 1: 311-30.0KHRTR-ND; Value: 30k; Part Number: RS_30k 0603; Component Kind: Standard; Component Type: Standard; Designator: RS_30k 0603; Pin Count: 2; Signal Integrity: Res; Simulation: RESISTOR
R63 R65 = RS_10k 0603: as R11 on sheet Main; LatestRevisionDate: 29 May 08; Supplier 1: Digi-Key; Supplier Part Number 1: 311-10.0KHRTR-ND; Value: 10k; Part Number: RS_10k 0603; Component Kind: Standard; Component Type: Standard; Designator: RS_10k 0603; Pin Count: 2; Signal Integrity: Res; Simulation: RESISTOR
R64 = RS_3k3 0603: RES 3.3K OHM 1/10W 5% 0603 SMD; Manufacturer: Yageo; Manufacturer PN: RC0603JR-073K3L; LatestRevisionDate: 1 Jun 08; Supplier 1: Digi-Key; Supplier Part Number 1: 311-3.3KGRTR-ND; Value: 3k3; Part Number: RS_3k3 0603; Component Kind: Standard; Component Type: Standard; Designator: RS_3k3 0603; Pin Count: 2; Signal Integrity: Res; Simulation: RESISTOR
R66 = RS_2k7 0603: RES 2.7K OHM 1/10W 5% 0603 SMD; Manufacturer: Yageo; Manufacturer PN: RC0603JR-072K7L; LatestRevisionDate: 6 May 2011; Supplier 1: Digi-Key; Supplier Part Number 1: 311-2.7KGRTR-ND; Value: 2k7; Part Number: RS_2k7 0603; Component Kind: Standard; Component Type: Standard; Designator: RS_2k7 0603; Pin Count: 2; Signal Integrity: Res; Simulation: RESISTOR
TP_3.3 TP_3.3_M TP_3.3_T TP_5 TP_5_T TP_12 TP_12_T TP_GND TP_GND_M TP_GND_T TP_V_BATT = TP_TESTPOINT: Test-Point; LatestRevisionDate: 29 May 08; Manufacturer PN: *; Manufacturer: *; Supplier 1: Digi-Key; Supplier Part Number 1: 5016KTR-ND; Value: TP; Part Number: TP_TESTPOINT; Component Type: Standard (No BOM); Designator: TP_TESTPOINT; Pin Count: 1
U5 = AT91SAM7X256-AU: as U5 on sheet Other; Published: 16-Oct-2006; DatasheetVersion: 17-Oct-2005; PackageVersion: Apr-2006; PackageReference: LQFP100; Publisher: Altium Limited; PackageDescription: 100-Pin Thin Quad Flat Pack 0.5 mm Pitch; Code_JEDEC: MS-026-BED; ComponentLink1Description: Manufacturer Link; ComponentLink1URL: http://www.atmel.com; ComponentLink2Description: Datasheet; ComponentLink2URL: http://www.atmel.com/dyn/resources/prod_documents/6120s.pdf
U6 = TSP7A4901: Supplier 1: TI Samples; Supplier Part Number 1: TSP7A4901
U7 = TPS7A6033-Q1: Supplier 1: TI Samples; Supplier Part Number 1: TPS7A6033-Q1
U8 = TPS7A6050-Q1: Supplier 1: TI Samples; Supplier Part Number 1: TPS7A6050-Q1

## Sheet Sensors.SchDoc
size A4
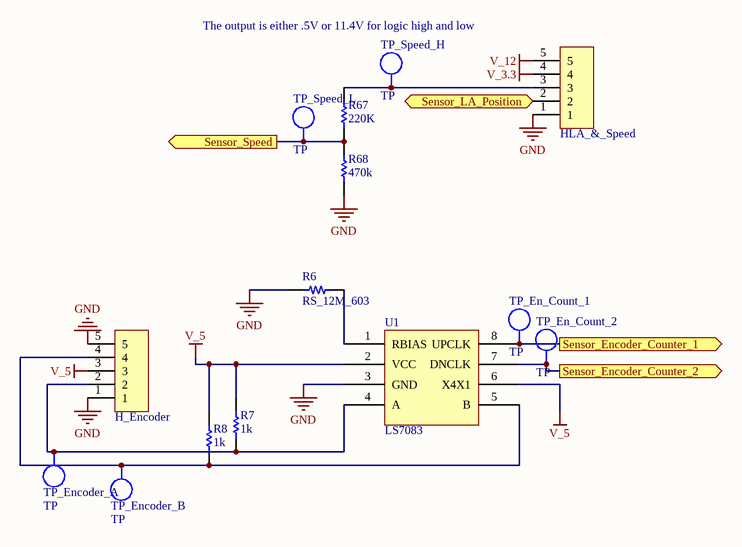
[diagram p5: Sensors.SchDoc]

### Parts
H_Encoder  53261-0571  [53261-0571]  (value not drawn)
HLA_&_Speed  53261-0571  [53261-0571]  (value not drawn)
R6  RS_12M_603  [0603 Resistor]
R7  1k  [0603]
R8  1k  [0603]
R67  220K  [0603]
R68  470k  [0603]
TP_En_Count_1  TP  [TEST_POINT_4X2MM]  (no BOM)
TP_En_Count_2  TP  [TEST_POINT_4X2MM]  (no BOM)
TP_Encoder_A  TP  [TEST_POINT_4X2MM]  (no BOM)
TP_Encoder_B  TP  [TEST_POINT_4X2MM]  (no BOM)
TP_Speed_H  TP  [TEST_POINT_4X2MM]  (no BOM)
TP_Speed_L  TP  [TEST_POINT_4X2MM]  (no BOM)
U1  LS7083

### Ports
Sensor_Encoder_Counter_1 (out), Sensor_Encoder_Counter_2 (out), Sensor_LA_Position (out), Sensor_Speed (out)

### Nets
GND: H_Encoder.1 H_Encoder.5 HLA_&_Speed.1 R6.1 R68.1 U1.3(GND)
V_3.3: HLA_&_Speed.4
V_5: H_Encoder.3 R7.2 R8.2 U1.2(VCC) U1.6(X4X1)
V_12: HLA_&_Speed.5
Sensor_Encoder_Counter_1: TP_En_Count_2.1 U1.7(DNCLK) ; port Sensor_Encoder_Counter_2
Sensor_Encoder_Counter_2: TP_En_Count_1.1 U1.8(UPCLK) ; port Sensor_Encoder_Counter_1
Sensor_LA_Position: HLA_&_Speed.2 ; port Sensor_LA_Position
Sensor_Speed: R67.1 R68.2 TP_Speed_L.1 ; port Sensor_Speed
NetH_Encoder_2: H_Encoder.2 R7.1 TP_Encoder_A.1 U1.4(A)
NetH_Encoder_4: H_Encoder.4 R8.1 TP_Encoder_B.1 U1.5(B)
NetHLA_&_Speed_3: HLA_&_Speed.3 R67.2 TP_Speed_H.1
NetR6_2: R6.2 U1.1(RBIAS)

### Notes on the sheet
- The output is either .5V or 11.4V for logic high and low

### Library data of the parts
H_Encoder HLA_&_Speed = 53261-0571: as USART0 on sheet Main; Supplier: Digikey; Supplier Part Number: WM7623CT-ND; Manufacturer Part Number: 53261-0571
R6 = RS_12M_603: Manufacturer: Panasonic - ECG; Manufacturer Part Number: ERJ-3GEYK126V; Supplier Part Number 1: P12MGCT-ND; Supplier 1: Digi-Key
R7 R8 = RS_1k 0603: as R51 on sheet Other; LatestRevisionDate: 17-Jul-2002; Supplier 1: Digi-Key; Supplier Part Number 1: RHM1.00KHTR-ND; Value: 1k; Part Number: RS_1k 0603; Component Kind: Standard; Component Type: Standard; Designator: RS_1k 0603; Pin Count: 2; Signal Integrity: Res; Simulation: RESISTOR
R67 = RS_220k 0603: RES 3.3K OHM 1/10W 5% 0603 SMD; Manufacturer: Yageo; Manufacturer PN: RC0603JR-073K3L; LatestRevisionDate: 1 Jun 08; Supplier 1: Digi-Key; Supplier Part Number 1: 311-220KGRTR-ND; Value: 220K; Part Number: RS_220k 0603; Component Kind: Standard; Component Type: Standard; Designator: RS_220k 0603; Pin Count: 2; Signal Integrity: Res; Simulation: RESISTOR
R68 = RS_470k 0603: RES 470K OHM 1/10W 5% 0603 SMD; Manufacturer: Yagep; Manufacturer PN: RC0603JR-07470KL; LatestRevisionDate: 25 June 2009; Supplier 1: Digi-Key; Value: 470k; Supplier Part Number 1: 311-470KGRTR-ND; Part Number: RS_470k 0603; Component Kind: Standard; Component Type: Standard; Designator: RS_470k 0603; Pin Count: 2; Signal Integrity: Res; Simulation: RESISTOR
TP_En_Count_1 TP_En_Count_2 TP_Encoder_A TP_Encoder_B TP_Speed_H TP_Speed_L = TP_TESTPOINT: Test-Point; LatestRevisionDate: 29 May 08; Manufacturer PN: *; Manufacturer: *; Supplier 1: Digi-Key; Supplier Part Number 1: 5016KTR-ND; Value: TP; Part Number: TP_TESTPOINT; Component Type: Standard (No BOM); Designator: TP_TESTPOINT; Pin Count: 1
U1 = LS7083: Manufacturer: LSI CSI; Supplier Part Number 1: U423428; Supplier 1: Active Components

## Sheet accelerator.SchDoc
size A
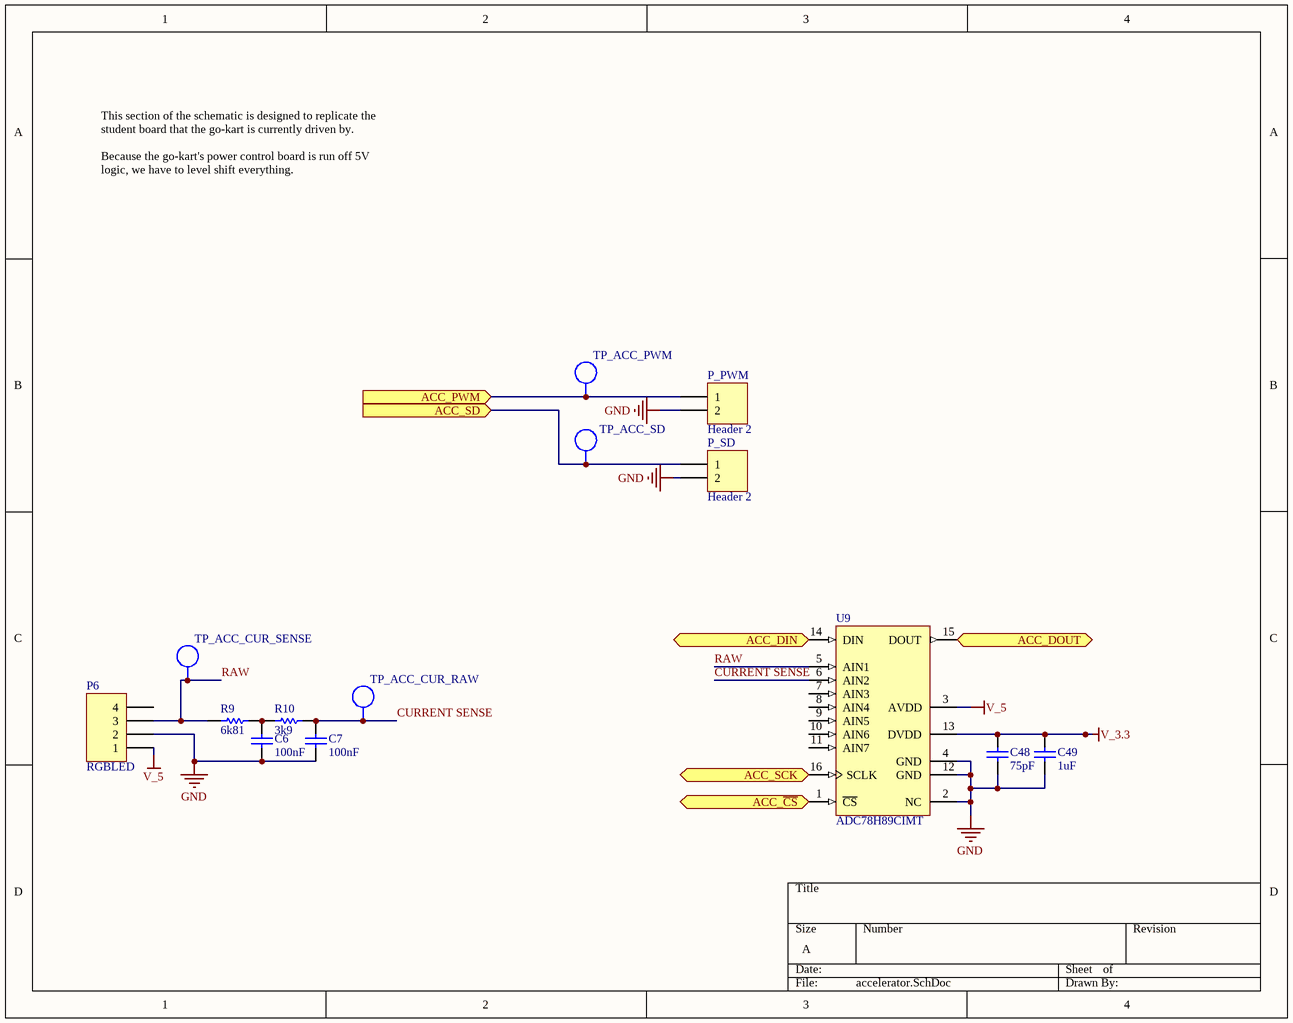
[diagram p6: accelerator.SchDoc]

### Parts
C6  100nF  [0603]
C7  100nF  [0603]
C48  value 75pF  [0603]  (hidden comment: CP_75pF 0603)
C49  1uF  [0603]
P6  RGBLED  [HDR1X4]
P_PWM  Header 2  [HDR1X2]
P_SD  Header 2  [HDR1X2]
R9  6k81  [0603]
R10  3k9  [0603]
TP_ACC_CUR_RAW  TP  [TEST_POINT_4X2MM]  (value not drawn)  (no BOM)
TP_ACC_CUR_SENSE  TP  [TEST_POINT_4X2MM]  (value not drawn)  (no BOM)
TP_ACC_PWM  TP  [TEST_POINT_4X2MM]  (value not drawn)  (no BOM)
TP_ACC_SD  TP  [TEST_POINT_4X2MM]  (value not drawn)  (no BOM)
U9  ADC78H89CIMT  [MTC16_N]

### Ports
ACC_DIN (in), ACC_DOUT (out), ACC_PWM (in), ACC_SCK (in), ACC_SD (in), ACC_~{CS} (in)

### Nets
GND: C6.1 C7.1 C48.1 C49.1 P6.2 P_PWM.2 P_SD.2 U9.2(NC) U9.4(GND) U9.12(GND)
V_3.3: C48.2 C49.2 U9.13(DVDD)
V_5: P6.1 U9.3(AVDD)
ACC_PWM_5: P_PWM.1 TP_ACC_PWM.1 ; port ACC_PWM
ACC_SD_5: P_SD.1 TP_ACC_SD.1 ; port ACC_SD
CURRENT SENSE: C7.2 R10.2 TP_ACC_CUR_RAW.1 U9.6(AIN2)
RAW: P6.3 R9.1 TP_ACC_CUR_SENSE.1 U9.5(AIN1)
SPI0_MISO: U9.15(DOUT) ; port ACC_DOUT
SPI0_MOSI: U9.14(DIN) ; port ACC_DIN
SPI0_NPCS0: U9.1(~{CS}) ; port ACC_~{CS}
SPI0_SPCK: U9.16(SCLK) ; port ACC_SCK
NetC6_2: C6.2 R9.2 R10.1

Not connected (* = marked no-connect by the designer): P6 4; U9 7(AIN3) 8(AIN4) 9(AIN5) 10(AIN6) 11(AIN7)

### Notes on the sheet
- This section of the schematic is designed to replicate the student board that the go-kart is currently driven by.
  Because the go-kart's power control board is run off 5V logic, we have to level shift everything.

### Library data of the parts
C6 C7 = CP_100nF 0603: as C42 on sheet Main; LatestRevisionDate: 29 May 08; Supplier 1: Digi-Key; Supplier Part Number 1: 478-6206-1-ND; Value: 100nF; Part Number: CP_100nF 0603; Component Kind: Standard; Component Type: Standard; Designator: CP_100nF 0603; Pin Count: 2; Signal Integrity: Cap; Simulation: CAP
C48 = CP_75pF 0603: CAP CER 75PF 50V 5% C0G 0603; Manufacturer: Murata Electronics; Manufacturer PN: GRM1885C1H750JA01D; LatestRevisionDate: 29 May 08; Supplier 1: Digi-Key; Supplier Part Number 1: 490-1424-2-ND; Part Number: CP_75pF 0603; Component Kind: Standard; Component Type: Standard; Designator: CP_75pF 0603; Pin Count: 2; Signal Integrity: Cap; Simulation: CAP
C49 = CP_1uF_50V_0603: CAP CER 1.0UF 50V X7R 0603; Manufacturer: Taiyo Yuden; Manufacturer PN: UMK107C5105KA-T; Supplier Part Number 1: 445-5090-2-ND; Supplier 1: Digi-Key; Value: 1uF; Part Number: CP_1uF_50V_0603; Component Kind: Standard; Component Type: Standard; Designator: CP_1uF_50V_0603; Pin Count: 2; Signal Integrity: Cap; Simulation: CAP
P6 = Header 4: Header, 4-Pin; LatestRevisionDate: 17-Jul-2002; LatestRevisionNote: Re-released for DXP Platform.; Publisher: Altium Limited; Supplier 1: ECE Store
P_PWM P_SD = Header 2: Header, 2-Pin; LatestRevisionDate: 17-Jul-2002; LatestRevisionNote: Re-released for DXP Platform.; Publisher: Altium Limited; Supplier 1: ECE Store
R9 = RS_6k81_0603: RES 6k81 OHM 1/10W 1% 0603 SMD; Manufacturer: Rohm; Manufacturer PN: MCR03EZPFX6811; Verify: Not Checked; LatestRevisionDate: 24 Feb 09; Supplier 1: Digi-Key; Supplier Part Number 1: RHM6.81KHTR-ND; Value: 6k81; Part Number: RS_6k81_0603; Component Kind: Standard; Component Type: Standard; Designator: RS_6k81_0603; Pin Count: 2; Signal Integrity: Res; Simulation: RESISTOR
R10 = RS_3k9 0603: RES 3.9K OHM 1/10W 5% 0603 SMD; Manufacturer: Yageo; Manufacturer PN: RC0603JR-073K9L; LatestRevisionDate: 6 May 2011; Supplier 1: Digi-Key; Supplier Part Number 1: 311-3.9KGRTR-ND; Value: 3k9; Part Number: RS_3k9 0603; Component Kind: Standard; Component Type: Standard; Designator: RS_3k9 0603; Pin Count: 2; Signal Integrity: Res; Simulation: RESISTOR
TP_ACC_CUR_RAW TP_ACC_CUR_SENSE TP_ACC_PWM TP_ACC_SD = TP_TESTPOINT: Test-Point; LatestRevisionDate: 29 May 08; Manufacturer PN: *; Manufacturer: *; Supplier 1: Digi-Key; Supplier Part Number 1: 5016KTR-ND; Value: TP; Part Number: TP_TESTPOINT; Component Type: Standard (No BOM); Designator: TP_TESTPOINT; Pin Count: 1
U9 = ADC78H89CIMT: 7-Channel, 500 KSPS, 12-Bit A/D Converter; Manufacturer: National Semiconductor; CompType: ADC IC; PackageTopMarking: NSUZXYTT*78H89*CIMT; PowerWise: Y; Published: 4-Dec-2008; DatasheetVersion: Apr-2003; PackageVersion: revD, Jun-2003; PackageReference: MTC16; Publisher: Altium Limited; PackageDescription: Molded TSSOP, Jedec, 5 x 4.4 x 0.9mm Body, 16 Lead, 0.65mm Pitch; PartNumber: ADC78H89CIMT; RoHS: O; PinCount: 16; DigiKeyPartNumber: ADC78H89CIMT-ND; Code_JEDEC: MO-153-AB; ComponentLink1Description: ADC78H89 Datasheet; ComponentLink1URL: http://www.national.com/ds/AD/ADC78H89.pdf; ComponentLink2Description: ADC78H89 Web Page; ComponentLink2URL: http://www.national.com/pf/AD/ADC78H89.html; ComponentLink3Description: MTC16 Package Page; ComponentLink3URL: http://www.national.com/packaging/folders/mtc16.html; Supplier 1: Digi-Key; Supplier Part Number 1: ADC78H89CIMT-ND

## Sheet LED_Display.SchDoc
size A4; Organization: ENEL429 Group N; Address1: ECE Department; Address2: University of Canterbury; Address3: Christchurch 8041; Address4: New Zealand; Revision: 1
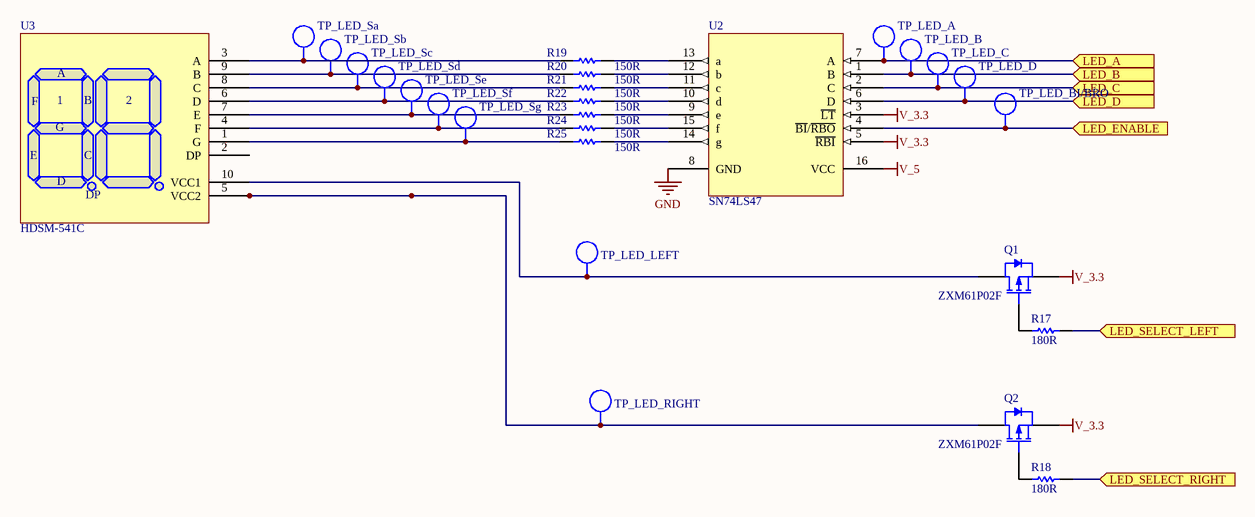
[diagram p7: LED_Display.SchDoc]

### Parts
Q1  ZXM61P02F  [SOT23]
Q2  ZXM61P02F  [SOT23]
R17  180R  [0603]
R18  180R  [0603]
R19  150R  [0603]
R20  150R  [0603]
R21  150R  [0603]
R22  150R  [0603]
R23  150R  [0603]
R24  150R  [0603]
R25  150R  [0603]
TP_LED_A  TP  [TEST_POINT_4X2MM]  (value not drawn)  (no BOM)
TP_LED_B  TP  [TEST_POINT_4X2MM]  (value not drawn)  (no BOM)
TP_LED_BI/BRO  TP  [TEST_POINT_4X2MM]  (value not drawn)  (no BOM)
TP_LED_C  TP  [TEST_POINT_4X2MM]  (value not drawn)  (no BOM)
TP_LED_D  TP  [TEST_POINT_4X2MM]  (value not drawn)  (no BOM)
TP_LED_LEFT  TP  [TEST_POINT_4X2MM]  (value not drawn)  (no BOM)
TP_LED_RIGHT  TP  [TEST_POINT_4X2MM]  (value not drawn)  (no BOM)
TP_LED_Sa  TP  [TEST_POINT_4X2MM]  (value not drawn)  (no BOM)
TP_LED_Sb  TP  [TEST_POINT_4X2MM]  (value not drawn)  (no BOM)
TP_LED_Sc  TP  [TEST_POINT_4X2MM]  (value not drawn)  (no BOM)
TP_LED_Sd  TP  [TEST_POINT_4X2MM]  (value not drawn)  (no BOM)
TP_LED_Se  TP  [TEST_POINT_4X2MM]  (value not drawn)  (no BOM)
TP_LED_Sf  TP  [TEST_POINT_4X2MM]  (value not drawn)  (no BOM)
TP_LED_Sg  TP  [TEST_POINT_4X2MM]  (value not drawn)  (no BOM)
U2  SN74LS47  [SOP127P780X200-16N]
U3  HDSM-541C  [HDSM-541C]

### Ports
LED_A (in), LED_B (in), LED_C (in), LED_D (in), LED_ENABLE (in), LED_SELECT_LEFT (in), LED_SELECT_RIGHT (in)

### Nets
GND: U2.8(GND)
V_3.3: Q1.2(S) Q2.2(S) U2.3(~{LT}) U2.5(~{RBI})
V_5: U2.16(VCC)
LED_A: TP_LED_A.1 U2.7(A) ; port LED_A
LED_B: TP_LED_B.1 U2.1(B) ; port LED_B
LED_C: TP_LED_C.1 U2.2(C) ; port LED_C
LED_D: TP_LED_D.1 U2.6(D) ; port LED_D
LED_ENABLE: TP_LED_BI/BRO.1 U2.4(~{BI}/~{RBO}) ; port LED_ENABLE
LED_SELECT_LEFT: R17.2 ; port LED_SELECT_LEFT
LED_SELECT_RIGHT: R18.2 ; port LED_SELECT_RIGHT
NetQ1_1: Q1.1(G) R17.1
NetQ1_3: Q1.3(D) TP_LED_LEFT.1 U3.10(VCC1)
NetQ2_1: Q2.1(G) R18.1
NetQ2_3: Q2.3(D) TP_LED_RIGHT.1 U3.5(VCC2)
NetR19_1: R19.1 TP_LED_Sa.1 U3.3(A)
NetR19_2: R19.2 U2.13(a)
NetR20_1: R20.1 TP_LED_Sb.1 U3.9(B)
NetR20_2: R20.2 U2.12(b)
NetR21_1: R21.1 TP_LED_Sc.1 U3.8(C)
NetR21_2: R21.2 U2.11(c)
NetR22_1: R22.1 TP_LED_Sd.1 U3.6(D)
NetR22_2: R22.2 U2.10(d)
NetR23_1: R23.1 TP_LED_Se.1 U3.7(E)
NetR23_2: R23.2 U2.9(e)
NetR24_1: R24.1 TP_LED_Sf.1 U3.4(F)
NetR24_2: R24.2 U2.15(f)
NetR25_1: R25.1 TP_LED_Sg.1 U3.1(G)
NetR25_2: R25.2 U2.14(g)

Not connected (* = marked no-connect by the designer): U3 2(DP)

### Notes on the sheet
- Title
- Drawn by:
- Date:
- Time:
- Revision:
- Sheet
- of
- File:

### Library data of the parts
Q1 Q2 = TF_ZXM61P02F: as Q3 on sheet USB; Supplier 1: Element 14; Supplier Part Number 1: 9525297; price: 1.31; Supplier 2: Digi-Key; Supplier Part Number 2: ZXM61P02FCT-ND; value: ZXM61P02F; Part Number: TF_ZXM61P02F; Component Kind: Standard; Component Type: Standard; Designator: TF_ZXM61P02F; Pin Count: 3; PCB3D: sot23
R17 R18 = RS_180R 0603: RES 180OHM 1/10W 1% 0603 SMD; Manufacturer: Panasonic - ECG; Manufacturer PN: ERJ-3EKF1800V; LatestRevisionDate: 25 June 2009; Supplier 1: Digi-Key; Supplier Part Number 1: P180HTR-ND; Value: 180R; Part Number: RS_180R 0603; Component Kind: Standard; Component Type: Standard; Designator: RS_180R 0603; Pin Count: 2; Signal Integrity: Res; Simulation: RESISTOR
R19-R25 = RS_150R 0603: RES 150 OHM 1/10W 1% 0603 SMD; Manufacturer: ROHM; Manufacturer PN: MCR03EZPFX1500; LatestRevisionDate: 4th July 08; Supplier 1: Digi-Key; Supplier Part Number 1: RHM150HTR-ND; Value: 150R; Part Number: RS_150R 0603; Component Kind: Standard; Component Type: Standard; Designator: RS_150R 0603; Pin Count: 2; Signal Integrity: Res; Simulation: RESISTOR
TP_LED_A TP_LED_B TP_LED_BI/BRO TP_LED_C TP_LED_D TP_LED_LEFT TP_LED_RIGHT TP_LED_Sa TP_LED_Sb TP_LED_Sc TP_LED_Sd TP_LED_Se TP_LED_Sf TP_LED_Sg = TP_TESTPOINT: Test-Point; LatestRevisionDate: 29 May 08; Manufacturer PN: *; Manufacturer: *; Supplier 1: Digi-Key; Supplier Part Number 1: 5016KTR-ND; Value: TP; Part Number: TP_TESTPOINT; Component Type: Standard (No BOM); Designator: TP_TESTPOINT; Pin Count: 1
U2 = SN74LS47: Manufacturer: Texas Instruments; Manufacturer PN: SN74LS47NSR; Supplier 1: Digikey; Supplier Part Number 1: 296-13223-1-ND
U3 = HDSM-541C: 2 character 7 segment display; Manufacturer: AVAGO TECHNOLOGIES; Manufacturer PN: HDSM-541C; Supplier 1: Digikey; Supplier Part Number 1: 516-2248-1-ND